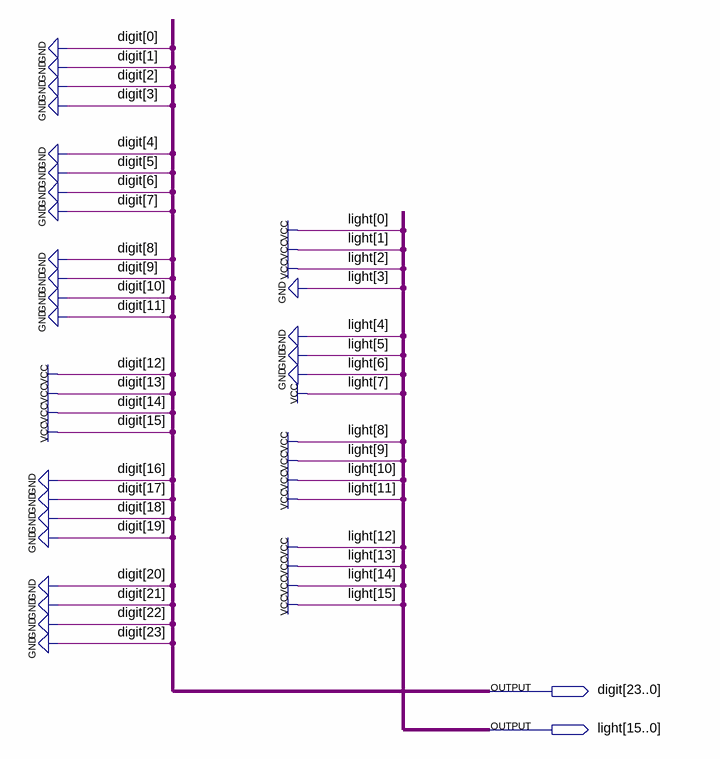
[diagram p0: schematic sheet]
// Quartus schematic Pattern_6_Frame_3.bdf as structural Verilog: 0 symbols, 2 pins
module Pattern_6_Frame_3 (
  output [23:0] digit,
  output [15:0] light
);


  assign digit = 24'b000000001111000000000000;
  assign light = 16'b1111111110000111;
endmodule
